# Altium project Smart_home_IOT - Copy.PrjPcb
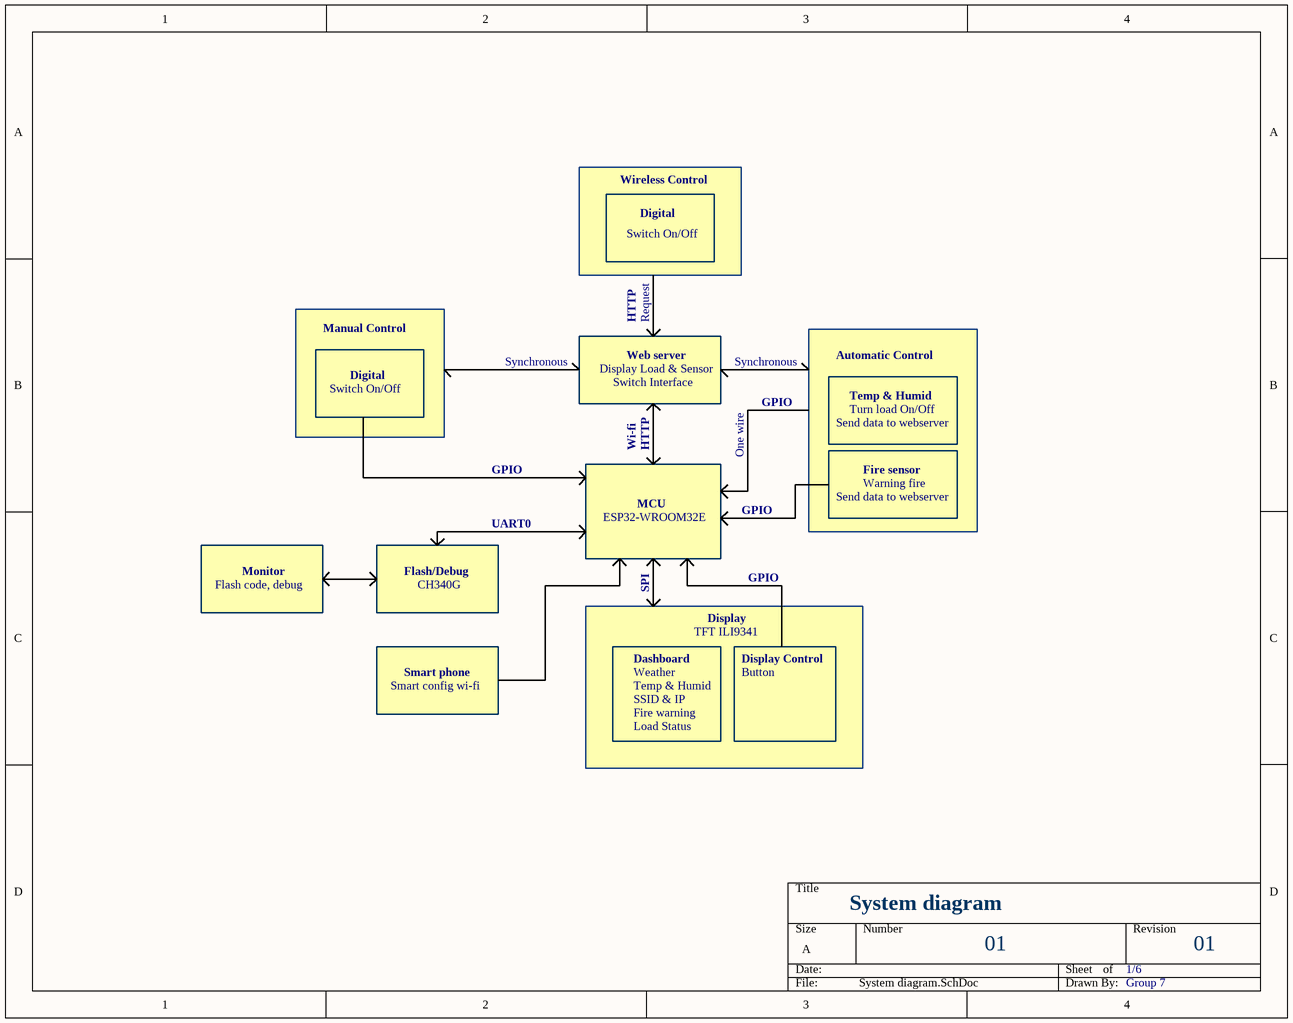
[diagram p0:  System diagram.SchDoc]
6 sheets, 122 parts. Net scope: flat (ports and power ports of the same name join across sheets).
Board files:  SMIOT_PCB_V2.PcbDoc,  SMIOT_PCB.PcbDoc,  SMIOT_Print.PcbDoc,  SMIOT_Single_Print.PcbDoc
Sheets:
   System diagram.SchDoc
   Power Diagram.SchDoc
   Power Circuit.SchDoc
   MCU.SchDoc
   Input.SchDoc
   Output.SchDoc

## Sheet  System diagram.SchDoc
size A; Author: Tinh Chau; DrawnBy: Group 7; SheetNumber: 1; SheetTotal: 6

### Notes on the sheet
- Wireless Control
- Switch On/Off
- Digital
- Manual Control
- Synchronous
- Display Load & Sensor
- Web server
- HTTP
- Request
- Automatic Control
- Switch Interface
- GPIO
- Send data to webserver
- Temp & Humid
- Turn load On/Off
- MCU
- Wi-fi
- One wire
- Fire sensor
- Warning fire
- UART0
- ESP32-WROOM32E
- Flash code, debug
- Monitor
- Flash/Debug
- CH340G
- SPI
- TFT ILI9341
- Display
- Smart config wi-fi
- Smart phone
- Dashboard
- Weather
- SSID & IP
- Display Control
- Button
- Fire warning
- Load Status
- System diagram
- 01
- 1/6
- Group 7

## Sheet  Power Diagram.SchDoc
size A; SheetNumber: 2; SheetTotal: 6
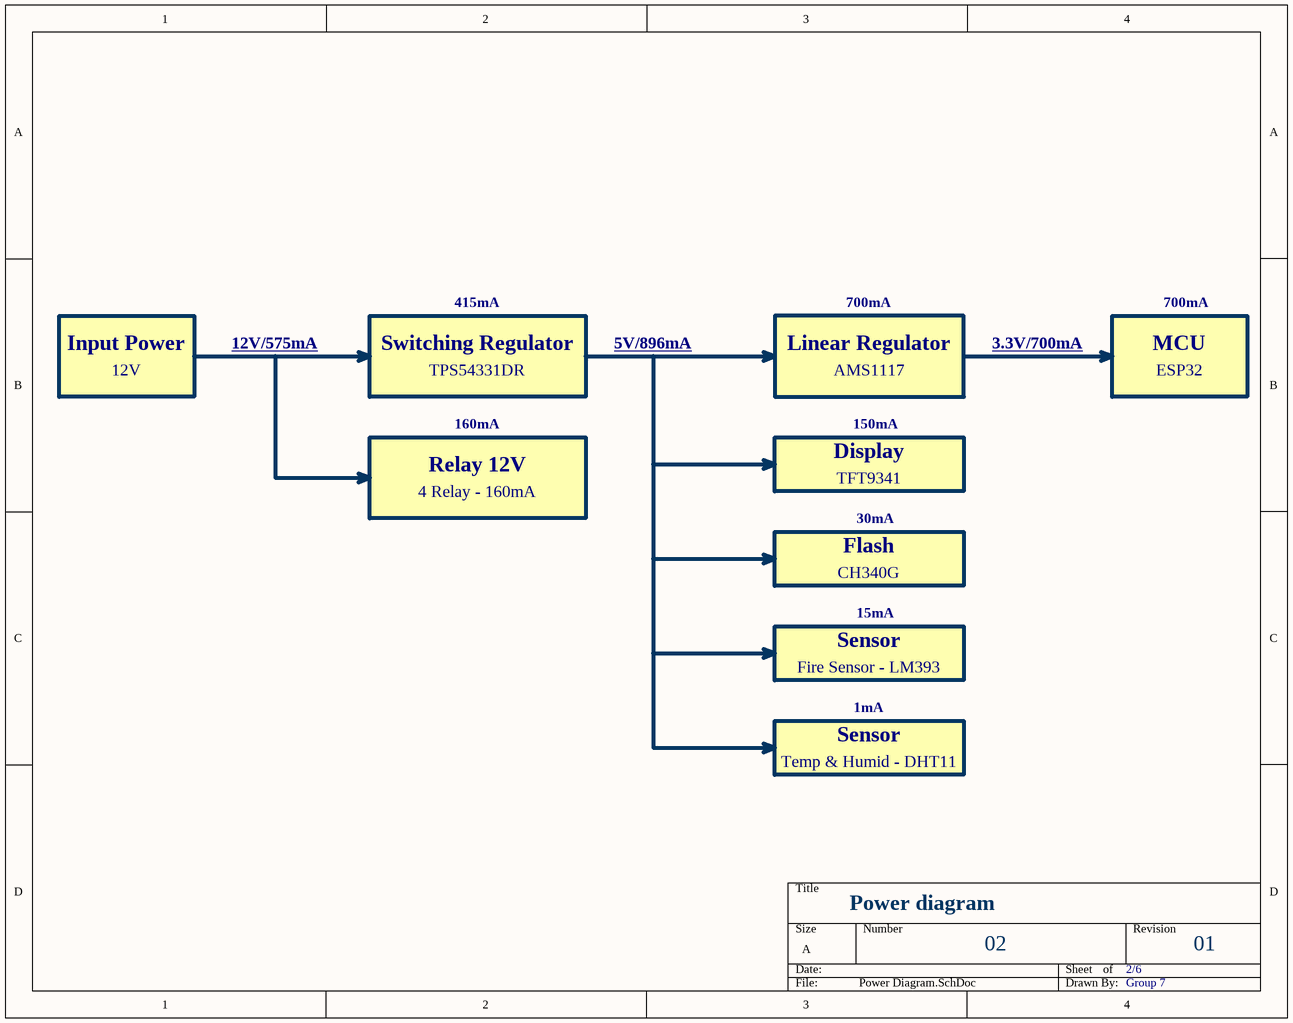
[diagram p1:  Power Diagram.SchDoc]

### Notes on the sheet
- 415mA
- 700mA
- Input Power
- 12V
- 12V/575mA
- TPS54331DR
- Switching Regulator
- 5V/896mA
- Linear Regulator
- AMS1117
- 3.3V/700mA
- MCU
- ESP32
- 160mA
- 150mA
- Relay 12V
- 4 Relay - 160mA
- Display
- TFT9341
- Flash
- CH340G
- 30mA
- Sensor
- 15mA
- Fire Sensor - LM393
- 1mA
- Temp & Humid - DHT11
- Power diagram
- 02
- 2/6
- 01
- Group 7

## Sheet  Power Circuit.SchDoc
size A; SheetNumber: 3; SheetTotal: 6
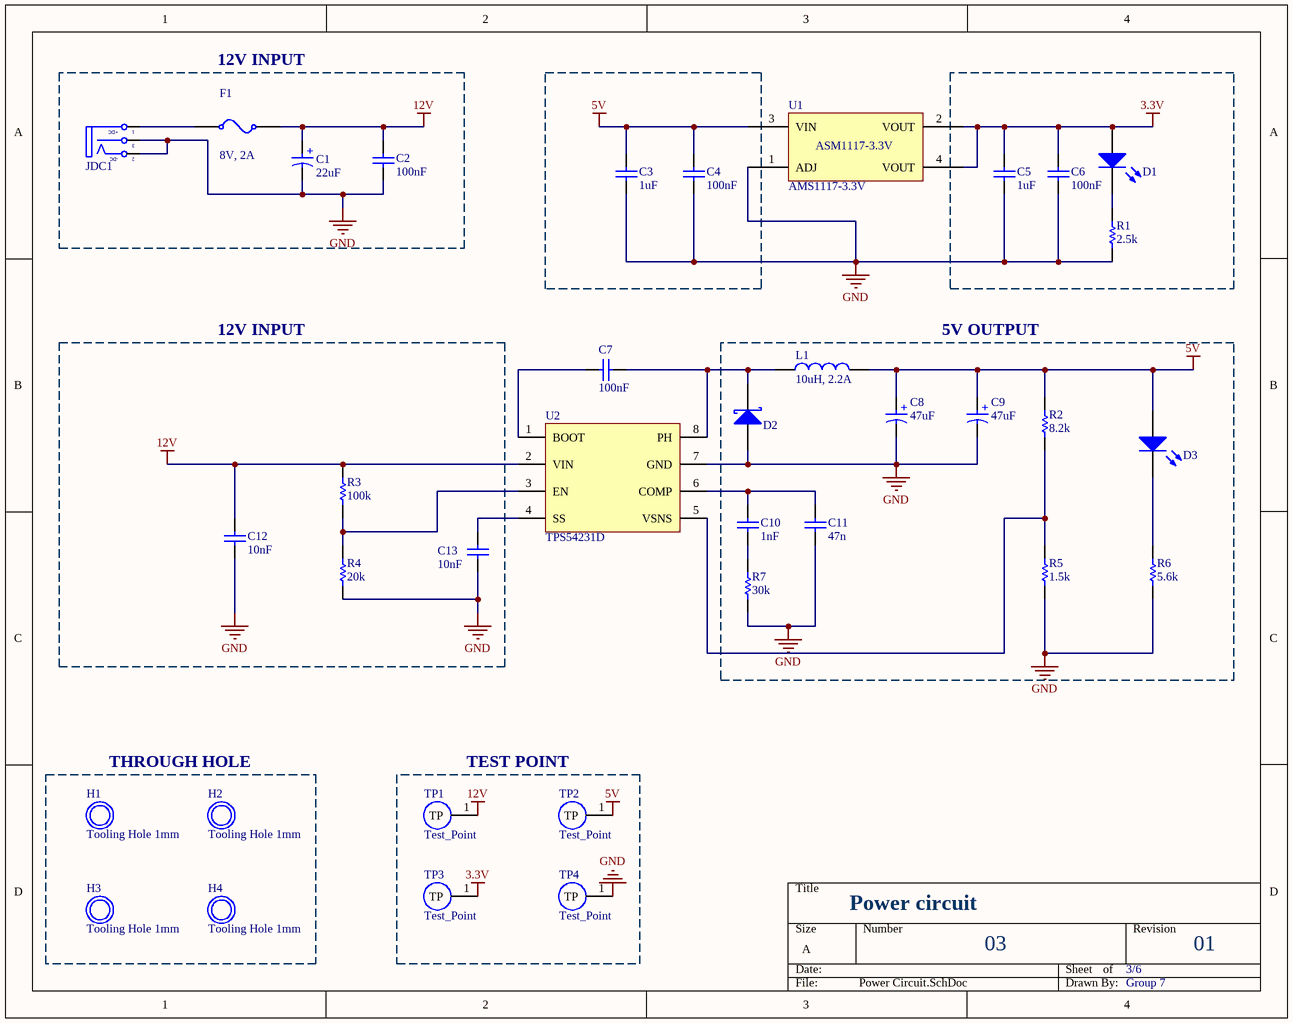
[diagram p2:  Power Circuit.SchDoc]

### Parts
C1  22uF  [WCAP-ASLI_D4H5.5]
C2  100nF  [CAP_0603]
C3  1uF  [CAP_0603]
C4  100nF  [CAP_0603]
C5  1uF  [CAP_0603]
C6  100nF  [CAP_0603]
C7  100nF  [CAP_0603]
C8  47uF  [WCAP-ASLI_D5H5.5]
C9  47uF  [WCAP-ASLI_D5H5.5]
C10  1nF  [CAP_0603]
C11  47n  [CAP_0603]
C12  10nF  [CAP_0603]
C13  10nF  [CAP_0603]
D1  LED SMD  [LED_0805_Blue]  (value not drawn)
D2  D Schottky  [SS34]  (value not drawn)
D3  LED SMD  [LED_0805_Blue]  (value not drawn)
F1  8V, 2A  [Fuse_SMD_1812]
H1  Tooling Hole 1mm  [2mm]
H2  Tooling Hole 1mm  [2mm]
H3  Tooling Hole 1mm  [2mm]
H4  Tooling Hole 1mm  [2mm]
JDC1  Jack DC  [DC-IN]  (value not drawn)
L1  10uH, 2.2A  [WE-PD2A_5848]
R1  2.5k  [resistor_0603]
R2  8.2k  [resistor_0603]
R3  100k  [resistor_0603]
R4  20k  [resistor_0603]
R5  1.5k  [resistor_0603]
R6  5.6k  [resistor_0603]
R7  30k  [resistor_0603]
TP1  Test_Point  [TP_2MM]
TP2  Test_Point  [TP_2MM]
TP3  Test_Point  [TP_2MM]
TP4  Test_Point  [TP_2MM]
U1  AMS1117-3.3V  [AMS1117-3.3V SOT223]
U2  TPS54231D  [SOIC8]

### Blocks framed on the sheet
12V INPUT: C1 C2 F1 JDC1
12V INPUT: C12 C13 R3 R4
5V OUTPUT: C8-C11 D2 D3 L1 R2 R5-R7
THROUGH HOLE: H1-H4
TEST POINT: TP1-TP4

### Nets
3.3V: C5.1 C6.1 D1.1(A) TP3.1(TP) U1.2(VOUT) U1.4(VOUT)
5V: C3.1 C4.1 C8.1(P) C9.1(P) D3.1(A) L1.2 R2.2 TP2.1(TP) U1.3(VIN)
12V: C1.1(P) C2.1 C12.1 F1.1 R3.1 TP1.1(TP) U2.2(VIN)
GND: C1.2(N) C2.2 C3.2 C4.2 C5.2 C6.2 C8.2(N) C9.2(N) C11.2 C12.2 C13.2 D2.1(A) JDC1.2(TN) JDC1.3(S) R1.2 R4.2 R5.2 R6.2 R7.2 TP4.1(TP) U1.1(ADJ) U2.7(GND)
NetC7_1: C7.1 U2.1(BOOT)
NetC7_2: C7.2 D2.2(K) L1.1 U2.8(PH)
NetC10_1: C10.1 C11.1 U2.6(COMP)
NetC10_2: C10.2 R7.1
NetC13_1: C13.1 U2.4(SS)
NetD1_2: D1.2(K) R1.1
NetD3_2: D3.2(K) R6.1
NetF1_0: F1.0 JDC1.1(T)
NetR2_1: R2.1 R5.1 U2.5(VSNS)
NetR3_2: R3.2 R4.1 U2.3(EN)

### Notes on the sheet
- Power circuit
- 03
- 3/6
- 01
- Group 7

### Library data of the parts
C1 = 865080340003: V-Chip, D4 x H5.5mm, 22uF, 16V; Capacitance Tolerance: +/-20%; Dissipation Factor: 16%; Endurance: 2000h; Leakage Current: 3.52uA; Ripple Current: 90mA; Supply 1 Name: Mouser; Supply 1 SN: 710-865080340003; Supply 2 Name: thegioiic; Category: Aluminum Electrolytic Capacitors; ComponentLink2Description: Datasheet Link; ComponentLink2URL: https://www.we-online.com/redexpert/spec/865080340003?ad; Mount: Surface Mount; Operating Temperature Max: 105°C; Operating Temperature Min: -55°C; Packaging: Tape and Reel; Height: 5.5mm; Diameter: 4mm; Capacitance: 22uF; Rated Voltage (DC): 16V; Supply 1 URL: https://www.mouser.com/ProductDetail/Wurth-Elektronik/865080340003?qs=0KOYDY2FL2%252BowmC4S50IuQ%3D%3D; Supply 2 URL: https://www.thegioiic.com/tu-nhom-smd-22uf-16v-4x5-4mm
C2 C4 C6 C7 = 01060310410: CAP, size 0603, 100nF; Supply 1 SN: 885012206095; Supply 1 name: Wurth Elektronik; Supply 2 name: Thegioiic; Capacitance Tolerance: +/-10%; ComponentLink1Description: Manufacturer; ComponentLink1URL: http://www.we-online.de; ComponentLink2Description: Datasheet; ComponentLink2URL: https://www.we-online.com/catalog/datasheet/885012206095.pdf; Operating Temperature: -55 to +125degC; Packaging: Tape and Reel; Supply 1 URL: https://www.we-online.com/en/components/products/WCAP-CSGP-50VDC?sq=885012206095R#885012206095R; Supply 2 SN: *; Supply 2 URL: https://www.thegioiic.com/tu-gom-0603-100nf-0-1uf-50v; Dissipation Factor: *; Height: *; Mounting Technology: SMT; Size: 0603; Capacitance: 100nF; Technical Reference: *
C3 C5 = 01060310510: CAP, size 0603, 1uF; Supply 1 SN: 885012206126; Supply 1 name: Wurth Elektronik; Supply 2 name: Thegioiic; Capacitance Tolerance: +/-10%; ComponentLink1Description: Manufacturer; ComponentLink1URL: http://www.we-online.de; ComponentLink2Description: Datasheet; ComponentLink2URL: https://www.we-online.com/components/products/datasheet/885012206126.pdf; Operating Temperature: -55 to +125degC; Packaging: Tape and Reel; Supply 1 URL: https://www.we-online.com/en/components/products/WCAP-CSGP-50VDC?sq=885012206126#885012206126; Supply 2 SN: *; Supply 2 URL: https://www.thegioiic.com/tu-gom-0603-1uf-50v; Dissipation Factor: *; Height: *; Mounting Technology: SMT; Size: 0603; Capacitance: 1uF; Technical Reference: *
C8 C9 = 865080342006: V-Chip, D5 x H5.5mm, 47uF, 16V; Capacitance Tolerance: +/-20%; Dissipation Factor: 16%; Endurance: 2000h; Leakage Current: 7.52uA; Ripple Current: 195mA; Supply 1 Name: Mouser; Supply 1 SN: 710-865080262015; Supply 2 Name: thegioiic; Category: Aluminum Electrolytic Capacitors; ComponentLink2Description: Datasheet Link; ComponentLink2URL: https://www.we-online.com/redexpert/spec/865080342006?ad; Mount: Surface Mount; Operating Temperature Max: 105°C; Operating Temperature Min: -55°C; Packaging: Tape and Reel; Height: 5.5mm; Diameter: 5mm; Capacitance: 47uF; Rated Voltage (DC): 16V; Supply 1 URL: https://www.mouser.com/ProductDetail/Wurth-Elektronik/865080262015?qs=0KOYDY2FL2%2Ffe5w2MssUoQ%3D%3D; Supply 2 URL: https://www.thegioiic.com/tu-nhom-smd-47uf-16v-5x5-4mm
C10 = 0106031025: CAP, size 0603, 1nF; Supply 1 SN: 885012006063; Supply 1 name: Wurth Elektronik; Capacitance Tolerance: +/-5%; ComponentLink1Description: Manufacturer; ComponentLink1URL: http://www.we-online.de; ComponentLink2Description: Datasheet; ComponentLink2URL: https://www.we-online.com/components/products/datasheet/885012006063.pdf; Operating Temperature: -55 to +125degC; Packaging: Tape and Reel; Supply 1 URL: https://www.we-online.com/en/components/products/WCAP-CSGP-50VDC?sq=885012007063#885012007063; Supply 2 SN: *; Supply 2 name: *; Supply 2 URL: *; Dissipation Factor: *; Height: *; Mounting Technology: SMT; Size: 0603; Capacitance: 1nF; Technical Reference: *
C11 = 01060347310: CAP, size 0603, 47nF; Supply 1 SN: 885012206093; Supply 1 name: Wurth Elektronik; Supply 2 name: Thegioiic; Capacitance Tolerance: +/-10%; ComponentLink1Description: Manufacturer; ComponentLink1URL: http://www.we-online.de; ComponentLink2Description: Datasheet; ComponentLink2URL: https://www.we-online.com/catalog/datasheet/885012206093.pdf; Operating Temperature: -55 to +125degC; Packaging: Tape and Reel; Supply 1 URL: https://www.we-online.com/en/components/products/WCAP-CSGP-50VDC?sq=885012206093#885012206093; Supply 2 SN: *; Supply 2 URL: https://www.thegioiic.com/tu-gom-0603-47nf-50v; Dissipation Factor: *; Height: *; Mounting Technology: SMT; Size: 0603; Capacitance: 47nF; Technical Reference: *
C12 C13 = 01060310310: CAP, size 0603, 10nF; Supply 1 SN: 885012206089; Supply 1 name: Wurth Elektronik; Supply 2 name: Thegioiic; Capacitance Tolerance: +/-10%; ComponentLink1Description: Manufacturer; ComponentLink1URL: http://www.we-online.de; ComponentLink2Description: Datasheet; ComponentLink2URL: https://www.we-online.com/catalog/datasheet/885012206089.pdf; Operating Temperature: -55 to +125degC; Packaging: Tape and Reel; Supply 1 URL: https://www.we-online.com/en/components/products/WCAP-CSGP-50VDC?sq=885012206089#885012206089; Supply 2 SN: *; Supply 2 URL: https://www.thegioiic.com/tu-gom-0603-10nf-50v; Dissipation Factor: *; Height: *; Mounting Technology: SMT; Size: 0603; Capacitance: 10nF; Technical Reference: *
D1 D3 = LED SMD: LED
D2 = D Schottky: Schottky Diode; Published: 8-Jun-2000; LatestRevisionDate: 17-Jul-2002; LatestRevisionNote: Re-released for DXP Platform.; PackageReference: SMB; Publisher: Altium Limited; PackageDescription: DO-214-AA/SMB; 2 C-Bend Leads; Body 5.3 x 3.6 mm, inc. leads (LxW); Code_JEDEC: DO-214-AA
F1 = 061812200008: Resettable Fuse, Size 1812, 8V, 2A; Manufacturer: Littelfuse; Threshold Current: 100A; Trip Current: 4A; Supply 1 Name: Mouser; Supply 1 SN: 650-MINISMDC200F-2; Supply 2 Name: Digikey; Supply 2 SN: MINISMDC200F-2TR-ND; Supply 3 Name: Thegioiic; Threshold Voltage: 8V; Hold Current: 2A; Size: 1812; Mounting Technology: SMT/SMD; ComponentLink1Description: Datasheet link; ComponentLink1URL: https://www.littelfuse.com/~/media/electronics/product_specifications/resettable_ptcs/littelfuse_ptc_minismdc300f_2_product_specification.pdf.pdf; ComponentLink2Description: Supply 1 URL; ComponentLink2URL: https://www.mouser.vn/ProductDetail/Littelfuse/MINISMDC200F-2?qs=F6FIpiMdEVbPu4q%2F42CC1w%3D%3D; ComponentLink3Description: Supply 2 URL; ComponentLink3URL: https://www.digikey.com/en/products/detail/littelfuse-inc/MINISMDC200F-2/1045898?s=N4IgTCBcDaIAQFkCSA5JBlBARAwmADPgGIC0EAugL5A; ComponentLink4Description: Supply 3 URL; ComponentLink4URL: https://www.thegioiic.com/cau-chi-tu-phuc-hoi-1812-8v-2a; Supply 3 SN: N/A
H1-H4 = Tooling Hole 2mm
JDC1 = Jack DC: Jack DC input; Value: Jac DC
L1 = 78477410: WE-PD2A SMT Power Inductor, size 5848, 10uH, 2.2A; Manufacturer: Wurth Elektronik; DC Resistance max.: 0.1Ohm; Saturation Current: 2.5A; Self Resonant Frequency: 26MHz; DC Resistance typ.: 0.078Ohm; Rated Voltage: 80VDC; Supply 1 Name: Digi-Key; Supply 1 SN: 732-6830-2-ND; Supply 2 Name: Mouser; Supply 2 SN: 710-78477410; Supply 3 Name: thegioiic; ComponentLink1Description: Manufacturer; ComponentLink1URL: http://www.we-online.de; ComponentLink2Description: Datasheet; ComponentLink2URL: https://www.we-online.com/catalog/datasheet/78477410.pdf; Manufacturer Part Number: 78477410; Published Date: May 2020; Rated Current: 2.2A; Inductance: 10uH; Operating Temperature: -40 to +125degC; Mounting Technology: SMT; Packaging: Tape and Reel; Size: 5848; Supply 1 URL: https://www.digikey.com/en/products/detail/w%C3%BCrth-elektronik/78477410/5168779?s=N4IgTCBcDaIOwA4Asc5IIwAYQF0C%2BQA; Supply 2 URL: https://www.mouser.vn/ProductDetail/Wurth-Elektronik/78477410?qs=sBf%2Fb4nBSldlX6CYaJExDg%3D%3D; Supply 3 URL: https://www.thegioiic.com/cuon-cam-dan-smd-cd53-5852-100-10uh-1-8a
R1 = 0006032525: RES, 2.5K Ohm, size 0603, 5%; Resistance tolerance: +/-5%; Rated Power: 1/4 W; Size: 0603; Mounting Technology: SMT; Datasheet: *; Resistance: 2.5K; ComponentLink1Description: Datasheet link; ComponentLink1URL: *; Supply 1 Name: *; Supply 1 SN: *; Supply 1 URL: *; Supply 2 Name: *; Supply 2 SN: *; Supply 2 URL: *; Supply 3 Name: *; Supply 3 SN: *; Supply 3 URL: *; Manufacture  Name: *; Manufacture  SN: *
R2 = 0006038251: RES, 8.2 kOhms, size 0603, 1%; Resistance tolerance: +/-1%; Rated Power: 1/4 W; Supply 1 Name: Mouser; Supply 1 SN: 660-HV731JTTD8204F; Supply 2 Name: Digi-Key; Supply 2 SN: 13-RC0603FR-078M2LTR-ND; Size: 0603; Mounting Technology: SMT; Resistance: 8.2K; ComponentLink1Description: Datasheet link; ComponentLink1URL: *; Supply 1 URL: https://www.mouser.vn/ProductDetail/KOA-Speer/HV731JTTD8204F?qs=ZqVPfSd1khqN0teaqWW7DA%3D%3D; Supply 2 URL: https://www.digikey.com/en/products/detail/yageo/RC0603FR-078M2L/5918418; Supply 3 Name: *; Supply 3 SN: *
R3 = 0006031041: RES, 100k Ohm, size 0603, 1%; Resistance Tolerant: +/-1%; Rated Power: 1/4W; Supply 1 Name: Mouser; Supply 1 SN: 603-SR0603FR-7T100KL; Supply 2 Name: Digikey; Supply 2 SN: YAG5821TR-ND YAG5821CT-ND YAG5821DKR-ND; Resistance: 100k; Size: 0603; Mounting Technology: SMT; ComponentLink1Description: Datasheet link; ComponentLink1URL: https://www.yageo.com/upload/media/product/productsearch/datasheet/rchip/PYu-SR_20105_RoHS_L_10.pdf; ComponentLink2Description: Supply 1 URL; ComponentLink2URL: https://www.mouser.vn/ProductDetail/YAGEO/SR0603FR-7T100KL?qs=sGAEpiMZZMvdGkrng054tz1y1XEHv7sNa%252BA%2F4WiDMf7aGw4zRBb%2FFQ%3D%3D; ComponentLink3Description: Supply 2 URL; ComponentLink3URL: https://www.digikey.com/en/products/detail/yageo/SR0603FR-7T100KL/9373095
R4 = 0006032031: RES, 20 kOhms, size 0603, 1%; Resistance tolerance: +/-1%; Rated Power: 1/4 W; Supply 1 Name: Mouser; Supply 1 SN: 667-ERJ-S03F2002V; Supply 2 Name: Digi-Key; Supply 2 SN: 13-RC0603FR-1320KLTR-ND; Size: 0603; Mounting Technology: SMT; Resistance: 20 k; ComponentLink1Description: Datasheet link; ComponentLink1URL: *; Supply 1 URL: https://www.mouser.vn/ProductDetail/Panasonic/ERJ-S03F2002V?qs=Zyl8A9hlmJopfTdqNIDujw%3D%3D; Supply 2 URL: https://www.digikey.com/en/products/detail/yageo/RC0603FR-1320KL/13694225; Supply 3 Name: *; Supply 3 SN: *
R5 = 0006031521: RES, 1.5 kOhms, size 0603, 1%; Resistance tolerance: +/-1%; Rated Power: 1/4 W; Supply 1 Name: Mouser; Supply 1 SN: 755-SFR03EZPF1501; Supply 2 Name: Digi-Key; Supply 2 SN: 13-RC0603FR-071R5LTR-ND; Size: 0603; Mounting Technology: SMT; Resistance: 1.5 k; ComponentLink1Description: Datasheet link; ComponentLink1URL: *; Supply 1 URL: https://www.mouser.vn/ProductDetail/ROHM-Semiconductor/SFR03EZPF1501?qs=byeeYqUIh0NryWvnzlukLQ%3D%3D; Supply 2 URL: https://www.digikey.com/en/products/detail/yageo/RC0603FR-071R5L/5918292; Supply 3 Name: *; Supply 3 SN: *
R6 = 0006035621: RES, 5.6k Ohm, size 0603, 1%; Resistance Tolerant: +/-1%; Rated Power: 1/4W; Supply 1 Name: Mouser; Supply 1 SN: 667-ERJ-UP3F5601V; Supply 2 Name: Digikey; Supply 2 SN: 10-ERJ-UP3F5601VTR-ND 10-ERJ-UP3F5601VCT-ND 10-ERJ-UP3F5601VDKR-ND; Resistance: 5.6k; Size: 0603; Mounting Technology: SMT; ComponentLink1Description: Datasheet link; ComponentLink1URL: https://api.pim.na.industrial.panasonic.com/file_stream/main/fileversion/4484; ComponentLink2Description: Supply 1 URL; ComponentLink2URL: https://www.mouser.vn/ProductDetail/Panasonic/ERJ-UP3F5601V?qs=sGAEpiMZZMvdGkrng054twq3eZrCFN89ezYxgAsnxBTZYD17cS%252B65A%3D%3D; ComponentLink3Description: Supply 2 URL; ComponentLink3URL: https://www.digikey.com/en/products/detail/panasonic-electronic-components/ERJ-UP3F5601V/12092890
R7 = 0006033205: RES, 30k Ohm, size 0603, 1%; Resistance tolerance: +/-1%; Rated Power: 1/4 W; Size: 0603; Mounting Technology: SMT; Datasheet: *; Resistance: 30k; ComponentLink1Description: Datasheet link; ComponentLink1URL: *; Supply 1 Name: *; Supply 1 SN: *; Supply 1 URL: *; Supply 2 Name: *; Supply 2 SN: *; Supply 2 URL: *; Supply 3 Name: *; Supply 3 SN: *; Supply 3 URL: *; Manufacture  Name: *; Manufacture  SN: *
TP1-TP4 = Test_Point: Test point, 2mm radius
U1 = AMS1117-3.3V: AMS1117-3.3V, OUT 3.3V 1A.; Manufacturer: AMS; Pad Count: 4; Current Output Maximum: 1A; Voltage Input Maximum: 15V; Manufacturer Part Number: *; Part Number: *; Current Input Maximum: *; Supplier 1 Link: *; Supplier 1 Name: *; Supplier 2 Link: *; Supplier 2 Name: *; Supplier 2 Part Number: *; Supplier 3 Link: https://www.thegioiic.com/ams1117-3-3v-ic-on-ap-3-3v-1a-sot-223; Supplier 3 Name: ThegioiIC; Supplier 3 Part Number: *; Voltage Output: 3.3V; Mounting Technology: SMD; Supplier 1 Part Number: *; Datasheet: http://www.advanced-monolithic.com/pdf/ds1117.pdf
U2 = TPS54231: Buck Switching Regulator IC Positive Adjustable 0.8V 1 Output 2A 8-SOIC (0.154", 3.90mm Width); Mfr: Texas Instruments; Function: Step-Down; Number of Outputs: 1; Voltage - Input (Min): 3.5V; Voltage - Input (Max): 28V; Voltage - Output (Max): 25V; Frequency - Switching: 570kHz; Category: Integrated Circuits (ICs); Output Configuration: Positive; Topology: Buck; Output Type: Adjustable; Voltage - Output (Min/Fixed): 0.8V; Current - Output: 2A; Operating Temperature: -40°C ~ 150°C (TJ); Mounting Type: Surface Mount; ComponentLink1Description: Thegioiic; ComponentLink1URL: https://www.thegioiic.com/tps54231dr-ic-dieu-chinh-giam-ap-2a-8-soic; ComponentLink2Description: Datasheet; ComponentLink2URL: https://www.ti.com/lit/ds/symlink/tps54231.pdf

## Sheet  MCU.SchDoc
size A; SheetNumber: 4; SheetTotal: 6
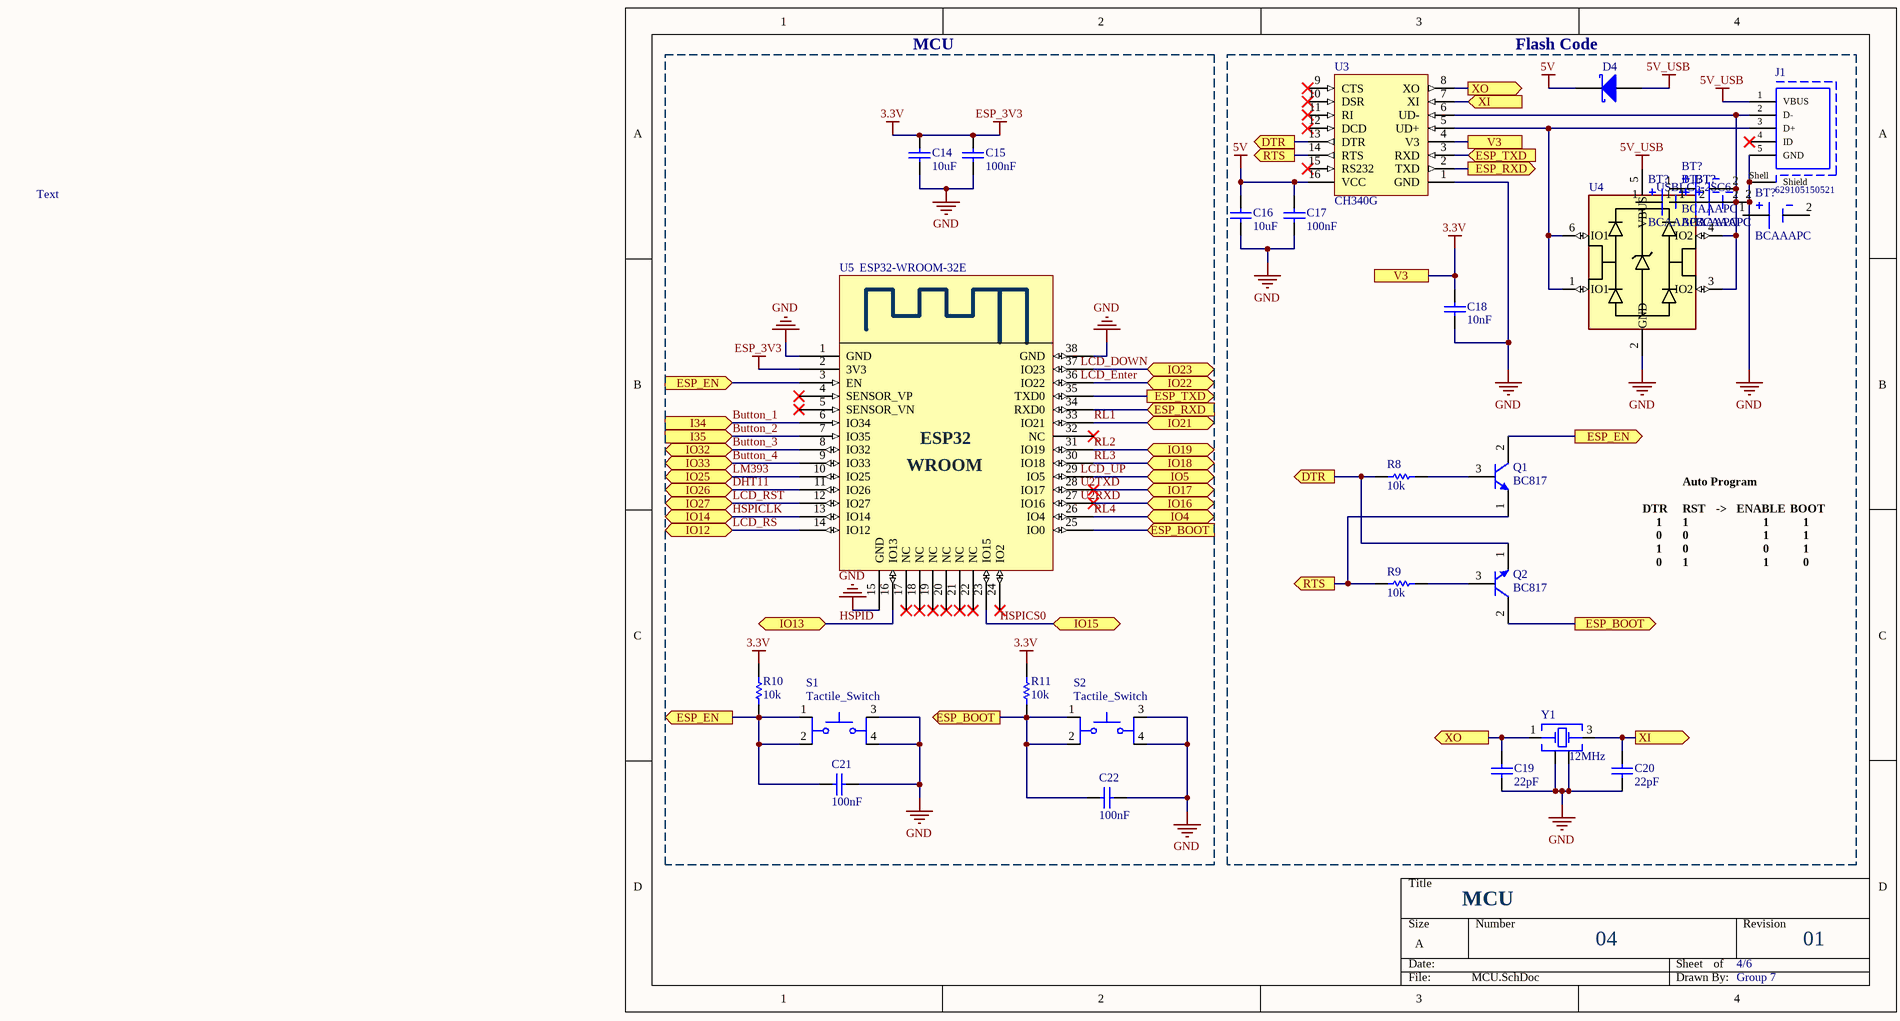
[diagram p3:  MCU.SchDoc, left]
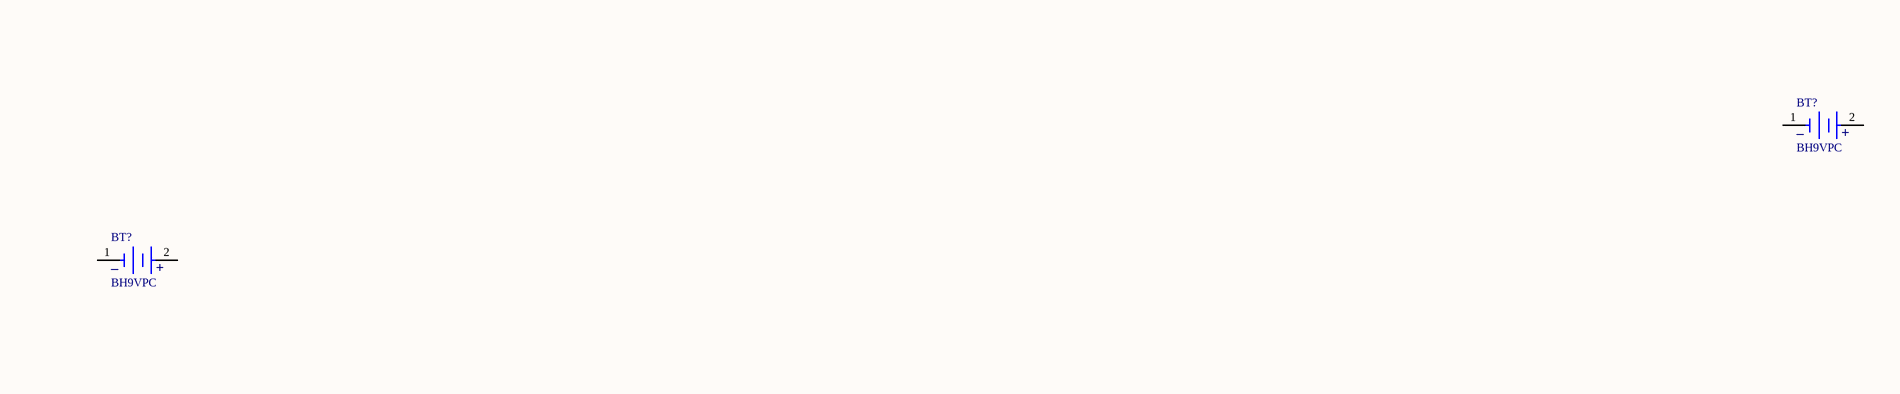
[diagram p4:  MCU.SchDoc, right]

### Parts
(Parts that share a designator on the sheet are numbered #1, #2 ... from top to bottom, then left to right.)
BT?#1  BCAAAPC  [BCAAAPC]
BT?#2  BCAAAPC  [BCAAAPC]
BT?#3  BCAAAPC  [BCAAAPC]
BT?#4  BCAAAPC  [BCAAAPC]
BT?#5  BCAAAPC  [BCAAAPC]
BT?#6  BCAAAPC  [BCAAAPC]
BT?#7  BH9VPC  [FP-BH9VPC-MFG]
BT?#8  BH9VPC  [FP-BH9VPC-MFG]
C14  10uF  [CAP_0603]
C15  100nF  [CAP_0603]
C16  10uF  [CAP_0603]
C17  100nF  [CAP_0603]
C18  10nF  [CAP_0603]
C19  22pF  [CAP_0603]
C20  22pF  [CAP_0603]
C21  100nF  [CAP_0603]
C22  100nF  [CAP_0603]
D4  D Schottky  [SS34]  (value not drawn)
J1  629105150521  [629105150521]
Q1  BC817  [SOT23B]
Q2  BC817  [SOT23B]
R8  10k  [resistor_0603]
R9  10k  [resistor_0603]
R10  10k  [resistor_0603]
R11  10k  [resistor_0603]
S1  Tactile_Switch  [Tactile_Button_3x4x2.5]
S2  Tactile_Switch  [Tactile_Button_3x4x2.5]
U3  CH340G  [DSIP-16]
U4  USBLC6-2SC6  [SOT95P280X145-6N]
U5  ESP32-WROOM-32E  [ESP32-WROOM]
Y1  12MHz  [WE-XTAL_CFPX-104]

### Blocks framed on the sheet
MCU: C14 C15 C21 C22 R10 R11 S1 S2 U5
Flash Code: BT?#1-BT?#6 C16-C20 D4 J1 Q1 Q2 R8 R9 U3 U4 Y1

### Ports
DTR (out), ESP_BOOT (in), ESP_BOOT (out), ESP_EN (in), ESP_EN (out), ESP_RXD (in), ESP_RXD (out), ESP_TXD (in), ESP_TXD (out), I34 (in), I35 (in), IO4 (bidir), IO5 (bidir), IO12 (bidir), IO13 (bidir), IO14 (bidir), IO15 (bidir), IO16 (bidir), IO17 (bidir), IO18 (bidir), IO19 (bidir), IO21 (bidir), IO22 (bidir), IO23 (bidir), IO25 (bidir), IO26 (bidir), IO27 (bidir), IO32 (bidir), IO33 (bidir), RTS (out), V3, XI (in), XI (out), XO (out)

### Nets
3.3V: C14.1 C15.1 C18.1 R10.1 R11.1 U3.4(V3) U5.2(3V3) ; port V3  [also labelled ESP_3V3]
5V: C16.2 C17.1 D4.2(K) U3.16(VCC)
5V_USB: D4.1(A) J1.1(VBUS) U4.5(VBUS)
GND: BT?#4.2(NEG) BT?#5.2(NEG) C14.2 C15.2 C16.1 C17.2 C18.2 C19.1 C20.1 C21.2 C22.2 J1.5(GND) J1.Shell(Shield) S1.3 S1.4 S2.3 S2.4 U3.1(GND) U4.2(GND) U5.1(GND) U5.15(GND) U5.38(GND) Y1.2(GND_&_Lid) Y1.4(GND_&_Lid)
Button_1: U5.6(IO34) ; port I34
Button_2: U5.7(IO35) ; port I35
Button_3: U5.8(IO32) ; port IO32
Button_4: U5.9(IO33) ; port IO33
DHT11: U5.11(IO26) ; port IO26
HSPICLK: U5.13(IO14) ; port IO14
HSPICS0: U5.23(IO15) ; port IO15
HSPID: U5.16(IO13) ; port IO13
LCD_Enter: U5.36(IO22) ; port IO22
LCD_RS: U5.14(IO12) ; port IO12
LCD_RST: U5.12(IO27) ; port IO27
LCD_UP: U5.29(IO5) ; port IO5
LDC_DOWN: U5.37(IO23) ; port IO23
LM393: U5.10(IO25) ; port IO25
RL1: U5.33(IO21) ; port IO21
RL2: U5.31(IO19) ; port IO19
RL3: U5.30(IO18) ; port IO18
RL4: U5.26(IO4) ; port IO4
NetBT?#1_2: BT?#1.2(NEG) BT?#3.2(NEG) J1.2(D-) U3.6(UD-) U4.3(IO2) U4.4(IO2)
NetBT?#4_1: BT?#4.1(POS) BT?#5.1(POS)
NetC19_2: C19.2 U3.8(XO) Y1.1(Crystal) ; port XO
NetC20_2: C20.2 U3.7(XI) Y1.3(Crystal) ; port XI
NetC21_1: C21.1 Q1.2(C) R10.2 S1.1 S1.2 U5.3(EN) ; port ESP_EN
NetC22_1: C22.1 Q2.2(C) R11.2 S2.1 S2.2 U5.25(IO0) ; port ESP_BOOT
NetJ1_3: J1.3(D+) U3.5(UD+) U4.1(IO1) U4.6(IO1)
NetQ1_1: Q1.1(E) R9.1 U3.14(RTS) ; port RTS
NetQ1_3: Q1.3(B) R8.2
NetQ2_1: Q2.1(E) R8.1 U3.13(DTR) ; port DTR
NetQ2_3: Q2.3(B) R9.2
NetU3_2: U3.2(TXD) U5.34(RXD0) ; port ESP_RXD
NetU3_3: U3.3(RXD) U5.35(TXD0) ; port ESP_TXD
NetU5_27: U5.27(IO16) ; port IO16
NetU5_28: U5.28(IO17) ; port IO17

Not connected (* = marked no-connect by the designer): BT?#1 1(POS); BT?#2 1(POS) 2(NEG); BT?#3 1(POS); BT?#6 1(POS) 2(NEG); BT?#7 1(NEG) 2(POS); BT?#8 1(NEG) 2(POS); J1 4(ID)*; U3 9(CTS)* 10(DSR)* 11(RI)* 12(DCD)* 15(RS232)*; U5 4(SENSOR_VP)* 5(SENSOR_VN)* 17(NC)* 18(NC)* 19(NC)* 20(NC)* 21(NC)* 22(NC)* 24(IO2)* 32(NC)*

### Notes on the sheet
- Text
- Auto Program
- DTR
- 1
- 0
- RST
- ->
- ENABLE
- BOOT
- MCU
- 04
- 4/6
- 01
- Group 7
- Labels drawn without touching a wire or pin: LCD_DOWN, LCD_Enter, LCD_UP, U2RXD, U2TXD

### Library data of the parts
BT?#1-BT?#6 = CMP-00029-00004-2: BATTERY HOLDER AAA PC PIN; ComponentLink1Description: Local Supply (Thegioiic); ComponentLink1URL: https://www.thegioiic.com/hop-pin-1xaaa-xuyen-lo-han-pcb
BT?#7 BT?#8 = CMP-00029-00001-2: Battery Holder (Open) 9V 1 Cell PC Pin.; RoHS Compliant: Yes; Mounting Technology: THT; Pins: 2; ComponentLink1URL: https://www.thegioiic.com/de-pin-9v-han-pcb; ComponentLink1Description: Local Supply 1 (Thegioiic
C14 C16 = 01060310010: CAP, size 0603,10uF; Supply 2 name: Thegioiic; Capacitance Tolerance: +/-10%; ComponentLink1Description: Manufacturer; ComponentLink1URL: *; ComponentLink2Description: Datasheet; ComponentLink2URL: *; Operating Temperature: -55 to +125degC; Packaging: Tape and Reel; Supply 1 SN: *; Supply 1 name: *; Supply 1 URL: *; Supply 2 SN: *; Supply 2 URL: https://www.thegioiic.com/tu-gom-0603-10uf-16v; Dissipation Factor: *; Height: *; Mounting Technology: SMT; Size: 0603; Capacitance: 10uF; Technical Reference: *
C15 C17 C21 C22 = 01060310410: as C2 on sheet  Power Circuit; ComponentLink1Description: Manufacturer; ComponentLink1URL: http://www.we-online.de; ComponentLink2Description: Datasheet; ComponentLink2URL: https://www.we-online.com/catalog/datasheet/885012206095.pdf; Operating Temperature: -55 to +125degC; Packaging: Tape and Reel; Supply 1 URL: https://www.we-online.com/en/components/products/WCAP-CSGP-50VDC?sq=885012206095R#885012206095R; Supply 2 SN: *; Supply 2 URL: https://www.thegioiic.com/tu-gom-0603-100nf-0-1uf-50v; Dissipation Factor: *; Height: *; Mounting Technology: SMT; Size: 0603; Capacitance: 100nF; Technical Reference: *
C18 = 01060310310: as C12 on sheet  Power Circuit; ComponentLink1Description: Manufacturer; ComponentLink1URL: http://www.we-online.de; ComponentLink2Description: Datasheet; ComponentLink2URL: https://www.we-online.com/catalog/datasheet/885012206089.pdf; Operating Temperature: -55 to +125degC; Packaging: Tape and Reel; Supply 1 URL: https://www.we-online.com/en/components/products/WCAP-CSGP-50VDC?sq=885012206089#885012206089; Supply 2 SN: *; Supply 2 URL: https://www.thegioiic.com/tu-gom-0603-10nf-50v; Dissipation Factor: *; Height: *; Mounting Technology: SMT; Size: 0603; Capacitance: 10nF; Technical Reference: *
C19 C20 = 01060322010: CAP, size 0603, 22pF; Supply 2 name: Thegioiic; Capacitance Tolerance: +/-10%; ComponentLink1Description: Manufacturer; ComponentLink1URL: Thegioiic; ComponentLink2Description: Datasheet; ComponentLink2URL: *; Operating Temperature: -55 to +125degC; Packaging: Tape and Reel; Supply 1 SN: *; Supply 1 name: *; Supply 1 URL: *; Supply 2 SN: *; Supply 2 URL: https://www.thegioiic.com/tu-gom-0603-22pf-50v; *: *; Height: *; Mounting Technology: SMT; Size: 0603; Capacitance: 22pF; Technical Reference: *
D4 = D Schottky: Schottky Diode; Published: 8-Jun-2000; LatestRevisionDate: 17-Jul-2002; LatestRevisionNote: Re-released for DXP Platform.; PackageReference: SMB; Publisher: Altium Limited; PackageDescription: DO-214-AA/SMB; 2 C-Bend Leads; Body 5.3 x 3.6 mm, inc. leads (LxW); Code_JEDEC: DO-214-AA
J1 = 629105150521: Micro USB 2.0 Type B Receptacle WR-COM, Horizontal, SMT, with Pegs, High Current at Pin 1 & Pin 5; Rated Current: 3 A; Contact Resistance: 30 mOhm; Working Voltage: 30 VAC; ComponentLink1Description: Manufacturer; ComponentLink1URL: http://www.we-online.de; ComponentLink2Description: Datasheet; ComponentLink2URL: https://katalog.we-online.de/em/datasheet/629105150521.pdf; Part Number: 629105150521; Published Date: September 2018; Publisher: Wurth Elektronik; Orientation: Horizontal; Connector Type: Micro USB 2.0 Type B; Operating Temperature: -40 to 85 degC; Mounting Technology: SMT; Gender: Receptacle; Packaging: Tape and Reel
Q1 Q2 = BC817: NPN Bipolar Transistor
R8-R11 = 0006031031: RES, 10k Ohm, size 0603, 1%; Resistance Tolerant: +/-1%; Rated Power: 1/4W; Supply 1 Name: Mouser; Supply 1 SN: 755-ESR03EZPF1002; Supply 2 Name: Digikey; Supply 2 SN: RHM10KADTR-ND RHM10KADCT-ND RHM10KADDKR-ND; Resistance: 10k; Size: 0603; Mounting Technology: SMT; ComponentLink1Description: Datasheet link; ComponentLink1URL: https://fscdn.rohm.com/en/products/databook/datasheet/passive/resistor/chip_resistor/esr-e.pdf; ComponentLink2Description: Supply 1 URL; ComponentLink2URL: https://www.mouser.vn/ProductDetail/ROHM-Semiconductor/ESR03EZPF1002?qs=sGAEpiMZZMvdGkrng054t67Efho1F8r6CDeAsqwFse8%3D; ComponentLink3Description: Supply 2 URL; ComponentLink3URL: https://www.digikey.com/en/products/detail/rohm-semiconductor/ESR03EZPF1002/1983429
S1 S2 = Tactile_Switch: Tactile Switch, 3x4x2.5mm; MP: TL6700AF160QG; Supplier 1 URL: https://www.thegioiic.com/nut-nhan-3x4mm-cao-2-5mm-4-chan-smd; Package: None; Price: None; Availability: Unavailable; ComponentLink1Description: New link; ComponentLink1URL: *; Supplier 1 Name: Thegioiic
U3 = CH340: USB Bridge, USB to UART USB 2.0 UART Interface; Mfr: SparkFun Electronics; Standards: USB 2.0; Voltage - Supply: 3V ~ 3.6V; Current - Supply: 20mA; Protocol: USB; Function: Bridge, USB to UART; Interface: UART; Operating Temperature: -20°C ~ 70°C (TA); ComponentLink1Description: Thegioiic; ComponentLink1URL: https://www.thegioiic.com/ch340g; ComponentLink2Description: Datasheet; ComponentLink2URL: https://www.thegioiic.com/upload/documents/5d39d5f0043101a4c964078db79fe1bd.PDF
U4 = USBLC6-2SC6: 17V Clamp 5A (8/20Âµs) Ipp Tvs Diode Surface Mount SOT-23-6
U5 = ESP32-WROOM: Bluetooth, WiFi 802.11b/g/n, Bluetooth v4.2 +EDR, Class 1, 2 and 3 Transceiver Module 2.4GHz ~ 2.5GHz Integrated, Trace Surface Mount; Mfr: Espressif Systems; Utilized IC / Part: ESP32-D0WD-V3; Modulation: CCK, DSSS, OFDM; Data Rate: 150Mbps; Power - Output: 20dBm; Sensitivity: -98dBm; Serial Interfaces: ADC, GPIO, I²C, I²S, PWM, SDIO, SPI, UART; Memory Size: 4MB Flash, 448kB ROM, 536kB SRAM; Voltage - Supply: 3V ~ 3.6V; Category: RF and Wireless; Series: ESP32; RF Family/Standard: Bluetooth, WiFi; Protocol: 802.11b/g/n, Bluetooth v4.2 +EDR, Class 1, 2 and 3; Frequency: 2.4GHz ~ 2.5GHz; Antenna Type: Integrated, Trace; Mounting Type: Surface Mount; ComponentLink1Description: Hshop; ComponentLink1URL: https://hshop.vn/products/mach-thu-phat-wifi-ble-soc-esp32-v1; Operating Temperature: -40°C ~ 85°C; ComponentLink2Description: Datasheet; ComponentLink2URL: https://www.espressif.com/sites/default/files/russianDocumentation/esp32-wroom-32e_esp32-wroom-32ue_datasheet_en.pdf
Y1 = 830055999: WE-XTAL Quartz Crystal, SMT, CFPX-104, 12MHz, +/-30ppm; Manufacturer: Wurth Elektronik; Load Capacitance: 18pF; ComponentLink1Description: Manufacturer; ComponentLink1URL: http://www.we-online.de; ComponentLink2Description: Datasheet; ComponentLink2URL: https://katalog.we-online.com/pbs/datasheet/830055999.pdf; Operating Temperature: -40 to +85degC; Packaging: Tape and Reel; Manufacturer Part Number: 830055999; Published Date: July 2020; Size: CFPX-104; Frequency Stability: +/-30ppm; Frequency: 12MHz; Frequency Tolerance: +/-30ppm; Mounting Technology: SMT

## Sheet  Input.SchDoc
size A; SheetNumber: 5; SheetTotal: 6
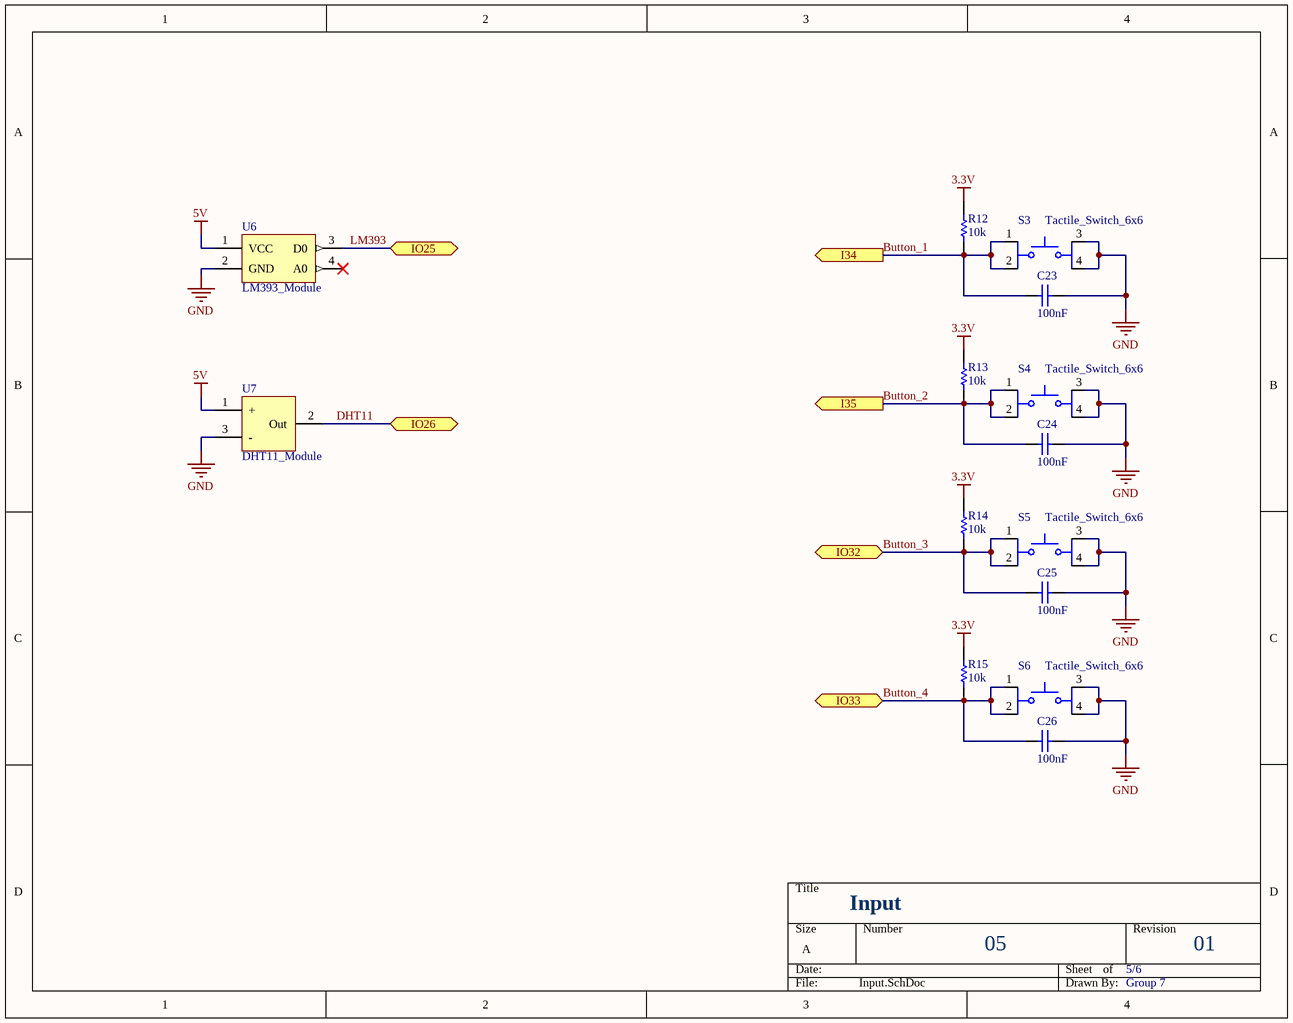
[diagram p5:  Input.SchDoc]

### Parts
C23  100nF  [CAP_0603]
C24  100nF  [CAP_0603]
C25  100nF  [CAP_0603]
C26  100nF  [CAP_0603]
R12  10k  [resistor_0603]
R13  10k  [resistor_0603]
R14  10k  [resistor_0603]
R15  10k  [resistor_0603]
S3  Tactile_Switch_6x6  [Tactile_Switch_6x6]
S4  Tactile_Switch_6x6  [Tactile_Switch_6x6]
S5  Tactile_Switch_6x6  [Tactile_Switch_6x6]
S6  Tactile_Switch_6x6  [Tactile_Switch_6x6]
U6  LM393_Module  [Flame Sensor]
U7  DHT11_Module  [DHT11_Module]

### Ports
I34 (out), I35 (out), IO25 (bidir), IO26 (bidir), IO32 (bidir), IO33 (bidir)

### Nets
3.3V: R12.1 R13.1 R14.1 R15.1
5V: U6.1(VCC) U7.1(+)
GND: C23.2 C24.2 C25.2 C26.2 S3.3 S3.4 S4.3 S4.4 S5.3 S5.4 S6.3 S6.4 U6.2(GND) U7.3(-)
Button_1: C23.1 R12.2 S3.1 S3.2 ; port I34
Button_2: C24.1 R13.2 S4.1 S4.2 ; port I35
Button_3: C25.1 R14.2 S5.1 S5.2 ; port IO32
Button_4: C26.1 R15.2 S6.1 S6.2 ; port IO33
DHT11: U7.2(Out) ; port IO26
LM393: U6.3(D0) ; port IO25

Not connected (* = marked no-connect by the designer): U6 4(A0)*

### Notes on the sheet
- Input
- 05
- 5/6
- 01
- Group 7

### Library data of the parts
C23-C26 = 01060310410: as C2 on sheet  Power Circuit; ComponentLink1Description: Manufacturer; ComponentLink1URL: http://www.we-online.de; ComponentLink2Description: Datasheet; ComponentLink2URL: https://www.we-online.com/catalog/datasheet/885012206095.pdf; Operating Temperature: -55 to +125degC; Packaging: Tape and Reel; Supply 1 URL: https://www.we-online.com/en/components/products/WCAP-CSGP-50VDC?sq=885012206095R#885012206095R; Supply 2 SN: *; Supply 2 URL: https://www.thegioiic.com/tu-gom-0603-100nf-0-1uf-50v; Dissipation Factor: *; Height: *; Mounting Technology: SMT; Size: 0603; Capacitance: 100nF; Technical Reference: *
R12-R15 = 0006031031: as R8 on sheet  MCU; Resistance: 10k; Size: 0603; Mounting Technology: SMT; ComponentLink1Description: Datasheet link; ComponentLink1URL: https://fscdn.rohm.com/en/products/databook/datasheet/passive/resistor/chip_resistor/esr-e.pdf; ComponentLink2Description: Supply 1 URL; ComponentLink2URL: https://www.mouser.vn/ProductDetail/ROHM-Semiconductor/ESR03EZPF1002?qs=sGAEpiMZZMvdGkrng054t67Efho1F8r6CDeAsqwFse8%3D; ComponentLink3Description: Supply 2 URL; ComponentLink3URL: https://www.digikey.com/en/products/detail/rohm-semiconductor/ESR03EZPF1002/1983429
S3-S6 = Tactile_Switch_6x6: Tactile Switch, 6x6mm
U6 = LM393_Module: Flame Sensor, 3.3V-5V, infrared, ouput: analog/digital.
U7 = DHT11_Module: Temperature & Humidity Sensor, 3.3V-5V, 5mA

## Sheet  Output.SchDoc
size A; SheetNumber: 6; SheetTotal: 6
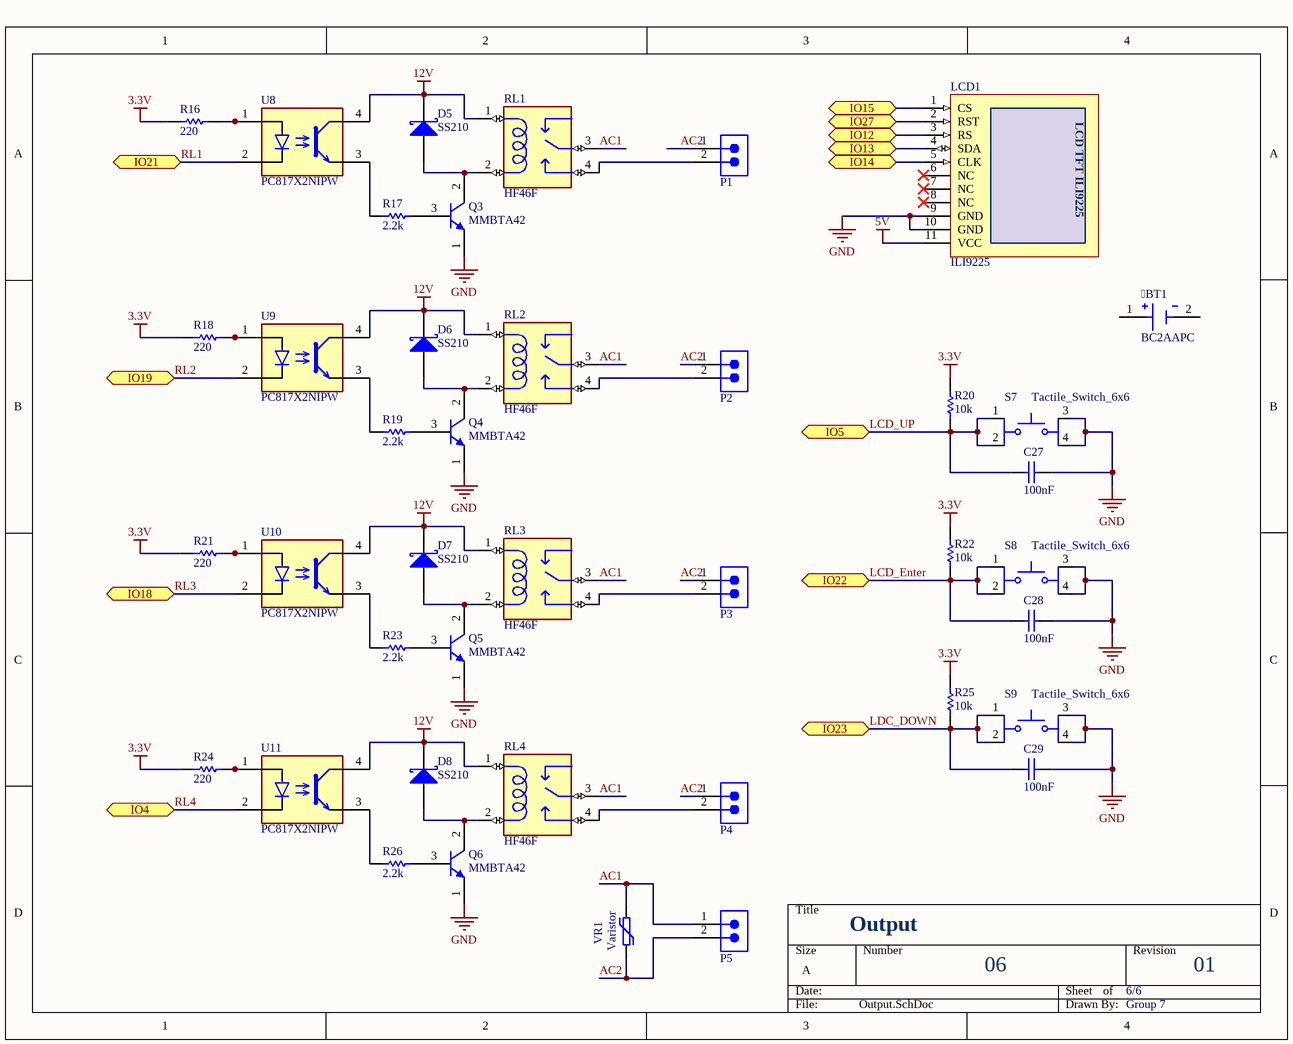
[diagram p6:  Output.SchDoc]

### Parts
BT1  BC2AAPC  [BC2AAPC]
C27  100nF  [CAP_0603]
C28  100nF  [CAP_0603]
C29  100nF  [CAP_0603]
D5  SS210  [SS34]
D6  SS210  [SS34]
D7  SS210  [SS34]
D8  SS210  [SS34]
LCD1  ILI9225  [LCD TFT ILI9225]
P1  691322310002  [691322310002]  (value not drawn)
P2  691322310002  [691322310002]  (value not drawn)
P3  691322310002  [691322310002]  (value not drawn)
P4  691322310002  [691322310002]  (value not drawn)
P5  691322310002  [691322310002]  (value not drawn)
Q3  MMBTA42  [SOT23B]
Q4  MMBTA42  [SOT23B]
Q5  MMBTA42  [SOT23B]
Q6  MMBTA42  [SOT23B]
R16  220  [resistor_0603]
R17  2.2k  [resistor_0603]
R18  220  [resistor_0603]
R19  2.2k  [resistor_0603]
R20  10k  [resistor_0603]
R21  220  [resistor_0603]
R22  10k  [resistor_0603]
R23  2.2k  [resistor_0603]
R24  220  [resistor_0603]
R25  10k  [resistor_0603]
R26  2.2k  [resistor_0603]
RL1  HF46F  [HF46F]
RL2  HF46F  [HF46F]
RL3  HF46F  [HF46F]
RL4  HF46F  [HF46F]
S7  Tactile_Switch_6x6  [Tactile_Switch_6x6]
S8  Tactile_Switch_6x6  [Tactile_Switch_6x6]
S9  Tactile_Switch_6x6  [Tactile_Switch_6x6]
U8  PC817X2NIPW  [PC817XI_SHP]
U9  PC817X2NIPW  [PC817XI_SHP]
U10  PC817X2NIPW  [PC817XI_SHP]
U11  PC817X2NIPW  [PC817XI_SHP]
VR1  Varistor  [07D471K]

### Ports
IO4 (bidir), IO5 (bidir), IO12 (bidir), IO13 (bidir), IO14 (bidir), IO15 (bidir), IO18 (bidir), IO19 (bidir), IO21 (bidir), IO22 (bidir), IO23 (bidir), IO27 (bidir)

### Nets
3.3V: R16.1 R18.1 R20.1 R21.1 R22.1 R24.1 R25.1
5V: LCD1.11(VCC)
12V: D5.2(K) D6.2(K) D7.2(K) D8.2(K) RL1.1(C1) RL2.1(C1) RL3.1(C1) RL4.1(C1) U8.4 U9.4 U10.4 U11.4
GND: C27.2 C28.2 C29.2 LCD1.9(GND) LCD1.10(GND) Q3.1(E) Q4.1(E) Q5.1(E) Q6.1(E) S7.3 S7.4 S8.3 S8.4 S9.3 S9.4
AC1: P5.1 RL1.3(C) RL2.3(C) RL3.3(C) RL4.3(C) VR1.1
AC2: P1.1 P2.1 P3.1 P4.1 P5.2 VR1.2
HSPICLK: LCD1.5(CLK) ; port IO14
HSPICS0: LCD1.1(CS) ; port IO15
HSPID: LCD1.4(SDA) ; port IO13
LCD_Enter: C28.1 R22.2 S8.1 S8.2 ; port IO22
LCD_RS: LCD1.3(RS) ; port IO12
LCD_RST: LCD1.2(RST) ; port IO27
LCD_UP: C27.1 R20.2 S7.1 S7.2 ; port IO5
LDC_DOWN: C29.1 R25.2 S9.1 S9.2 ; port IO23
RL1: U8.2 ; port IO21
RL2: U9.2 ; port IO19
RL3: U10.2 ; port IO18
RL4: U11.2 ; port IO4
NetD5_1: D5.1(A) Q3.2(C) RL1.2(C2)
NetD6_1: D6.1(A) Q4.2(C) RL2.2(C2)
NetD7_1: D7.1(A) Q5.2(C) RL3.2(C2)
NetD8_1: D8.1(A) Q6.2(C) RL4.2(C2)
NetP1_2: P1.2 RL1.4(NO)
NetP2_2: P2.2 RL2.4(NO)
NetP3_2: P3.2 RL3.4(NO)
NetP4_2: P4.2 RL4.4(NO)
NetQ3_3: Q3.3(B) R17.2
NetQ4_3: Q4.3(B) R19.2
NetQ5_3: Q5.3(B) R23.2
NetQ6_3: Q6.3(B) R26.2
NetR16_2: R16.2 U8.1
NetR17_1: R17.1 U8.3
NetR18_2: R18.2 U9.1
NetR19_1: R19.1 U9.3
NetR21_2: R21.2 U10.1
NetR23_1: R23.1 U10.3
NetR24_2: R24.2 U11.1
NetR26_1: R26.1 U11.3

Not connected (* = marked no-connect by the designer): BT1 1(POS) 2(NEG); LCD1 6(NC)* 7(NC)* 8(NC)*

### Notes on the sheet
- Output
- 06
- 6/6
- 01
- Group 7

### Library data of the parts
BT1 = CMP-00029-00003-2: Battery Holder Aa 2 Cell Pc Pin; Pins: 2; Supplier Locally URL: https://www.thegioiic.com/hop-pin-2xaa-xuyen-lo-han-pcb; Supplier Locally Name: Thegioiic; Mounting Technology: THT
C27-C29 = 01060310410: as C2 on sheet  Power Circuit; ComponentLink1Description: Manufacturer; ComponentLink1URL: http://www.we-online.de; ComponentLink2Description: Datasheet; ComponentLink2URL: https://www.we-online.com/catalog/datasheet/885012206095.pdf; Operating Temperature: -55 to +125degC; Packaging: Tape and Reel; Supply 1 URL: https://www.we-online.com/en/components/products/WCAP-CSGP-50VDC?sq=885012206095R#885012206095R; Supply 2 SN: *; Supply 2 URL: https://www.thegioiic.com/tu-gom-0603-100nf-0-1uf-50v; Dissipation Factor: *; Height: *; Mounting Technology: SMT; Size: 0603; Capacitance: 100nF; Technical Reference: *
D5-D8 = D Schottky: Schottky Diode; Published: 8-Jun-2000; LatestRevisionDate: 17-Jul-2002; LatestRevisionNote: Re-released for DXP Platform.; PackageReference: SMB; Publisher: Altium Limited; PackageDescription: DO-214-AA/SMB; 2 C-Bend Leads; Body 5.3 x 3.6 mm, inc. leads (LxW); Code_JEDEC: DO-214-AA
LCD1 = LCD TFT: The ILI9225 is a 262,144-color one-chip SoC driver for a-TFT liquid crystal display with resolution of 176RGBx220 dots, comprising a 528-channel source driver, a 220-channel gate driver, 87120 bytes RAM for graphic data of 176RGBx220 dots, and power supply circuit.; Display Color: 16BIT RGB 65K color; Screen Size: 2.2(inch); Resolution: 176*220 (Pixel); Module Interface: 4-wire SPI interface; Backlight: 3 White Led; Active Area: 34.85x43.56 (mm); Module PCB Size: 42.46x67.20 (mm); Operating Voltage: 5V/3.3V; Power Consumption: TBD; Rough Weight(Package containing): 23 (g); SKU: MAR2201; Type: TFT; Driver IC: ILI9225; Operating Temperature: -20℃~60℃; Storage Temperature: -30℃~70℃; ComponentLink1Description: Hshop; ComponentLink1URL: https://hshop.vn/products/man-hinh-lcd-tft-2-inch-ili9225-giao-tiep-spi; ComponentLink2Description: Thegioiic; ComponentLink2URL: https://www.thegioiic.com/lcd-2inch-176x220-tft-ili9225-giao-tiep-spi
P1-P5 = 691322310002: WR-TBL Series 322 Horizontal PCB Header, THT, pitch 3.81mm, 2p; Manufacturer: Wurth Elektronik; Modularity: No; Rated Current: 10A; Working Voltage: 300V; Supply 3 Name: ThegioiIC; ComponentLink1Description: Website Link; ComponentLink1URL: https://www.we-online.com/redexpert/article/691322310002?ad; ComponentLink2Description: Datasheet Link; ComponentLink2URL: https://www.we-online.com/redexpert/spec/691322310002?ad; Manufacturer Part Number: 691322310002; Category: Terminal Blocks; Match Code: WR-TBL; Mount: Through Hole; Operating Temperature Max: 105°C; Operating Temperature Min: -40°C; Packaging: Box; Application: Pluggable; Number of Pins: 2; Number of Rows: 1; Orientation: Horizontal; Pitch: 3.81mm; Supply 1 Name: *; Supply 1 SN: *; Supply 1 URL: *; Supply 2 Name: *; Supply 2 SN: *; Supply 2 URL: *; Supply 3 SN: *; Supply 3 URL 1: https://www.thegioiic.com/kf-3-81-2-r-terminal-block-plug-in-han-pcb-2-chan-cong-3-81mm-300v-10a; Supply 3 URL 2: https://www.thegioiic.com/ul-3-81-2-r-terminal-block-plug-in-han-pcb-2-chan-cong-3-81mm-300v-10a-ulo
Q3-Q6 = BC817: NPN Bipolar Transistor
R16 R18 R21 R24 = 0006032211: RES, 220 Ohm, size 0603, 1%; Resistance Tolerant: +/-1%; Rated Power: 1/4W; Supply 1 Name: Mouser; Supply 1 SN: 667-ERJ-UP3F2200V; Supply 2 Name: Digikey; Supply 2 SN: 10-ERJ-UP3F2200VTR-ND 10-ERJ-UP3F2200VCT-ND 10-ERJ-UP3F2200VDKR-ND; Resistance: 220; Size: 0603; Mounting Technology: SMT; ComponentLink1Description: Datasheet link; ComponentLink1URL: https://api.pim.na.industrial.panasonic.com/file_stream/main/fileversion/4484; ComponentLink2Description: Supply 1 URL; ComponentLink2URL: https://www.mouser.vn/ProductDetail/Panasonic/ERJ-UP3F2200V?qs=sGAEpiMZZMvdGkrng054twq3eZrCFN89E%252BhCXuCu3h8RslmTO1I28Q%3D%3D; ComponentLink3Description: Supply 2 URL; ComponentLink3URL: https://www.digikey.com/en/products/detail/panasonic-electronic-components/ERJ-UP3F2200V/12092129
R17 R19 R23 R26 = 0006032221: RES, 2.2k Ohm, size 0603, 1%; Resistance Tolerant: +/-1%; Rated Power: 1/4W; Supply 1 Name: Mouser; Supply 1 SN: 667-ERJ-UP3F2201V; Supply 2 Name: Digikey; Supply 2 SN: 10-ERJ-UP3F2201VTR-ND 10-ERJ-UP3F2201VCT-ND 10-ERJ-UP3F2201VDKR-ND; Supply 3 Name: thegioiic; Supply 3 SN: NA; Resistance: 2.2k; Size: 0603; Mounting Technology: SMT; ComponentLink1Description: Datasheet link; ComponentLink1URL: https://api.pim.na.industrial.panasonic.com/file_stream/main/fileversion/4484; ComponentLink2Description: Supply 1 URL; ComponentLink2URL: https://www.mouser.vn/ProductDetail/Panasonic/ERJ-UP3F2201V?qs=sGAEpiMZZMvdGkrng054twq3eZrCFN89KeaXYJ5LTWyJgfuuVVfZrw%3D%3D; ComponentLink3Description: Supply 2 URL; ComponentLink3URL: https://www.digikey.com/en/products/detail/panasonic-electronic-components/ERJ-UP3F2201V/12092708; ComponentLink4Description: Supply 3 URL; ComponentLink4URL: https://www.thegioiic.com/dien-tro-2-2-kohm-0603-1
R20 R22 R25 = 0006031031: as R8 on sheet  MCU; Resistance: 10k; Size: 0603; Mounting Technology: SMT; ComponentLink1Description: Datasheet link; ComponentLink1URL: https://fscdn.rohm.com/en/products/databook/datasheet/passive/resistor/chip_resistor/esr-e.pdf; ComponentLink2Description: Supply 1 URL; ComponentLink2URL: https://www.mouser.vn/ProductDetail/ROHM-Semiconductor/ESR03EZPF1002?qs=sGAEpiMZZMvdGkrng054t67Efho1F8r6CDeAsqwFse8%3D; ComponentLink3Description: Supply 2 URL; ComponentLink3URL: https://www.digikey.com/en/products/detail/rohm-semiconductor/ESR03EZPF1002/1983429
RL1-RL4 = HF46F: SeriesHF46F 12V 1 Form A 1A Gold Plated SUBMINIATURE INTERMEDIATE POWER RELAY; MF: Hongfa; Package: None; Price: None; Value: *; SnapEDA_Link: https://www.snapeda.com/parts/HF46F/Hongfa/view-part/?ref=snap; MP: HF46F; Availability: Not in stock; Check_prices: https://www.snapeda.com/parts/HF46F/Hongfa/view-part/?ref=eda
S7-S9 = Tactile_Switch_6x6: Tactile Switch, 6x6mm
U8-U11 = PC817X2NIPW: PC817 series, SMD, I_F (max) = 500mA, V_F (max) = 1.4V. / Breakdown voltage: BV_CE = 80V, BV_BE = 6V.
VR1 = 07D471K 470V

## Nets that join several sheets
3.3V:  Power Circuit (6 pins),  MCU (7 pins),  Input (R12.1 R13.1 R14.1 R15.1),  Output (7 pins)
5V:  Power Circuit (9 pins),  MCU (C16.2 C17.1 D4.2 U3.16),  Input (U6.1 U7.1),  Output (LCD1.11)
12V:  Power Circuit (7 pins),  Output (12 pins)
GND:  Power Circuit (22 pins),  MCU (24 pins),  Input (14 pins),  Output (15 pins)
Button_1:  MCU (U5.6),  Input (C23.1 R12.2 S3.1 S3.2)
Button_2:  MCU (U5.7),  Input (C24.1 R13.2 S4.1 S4.2)
Button_3:  MCU (U5.8),  Input (C25.1 R14.2 S5.1 S5.2)
Button_4:  MCU (U5.9),  Input (C26.1 R15.2 S6.1 S6.2)
DHT11:  MCU (U5.11),  Input (U7.2)
HSPICLK:  MCU (U5.13),  Output (LCD1.5)
HSPICS0:  MCU (U5.23),  Output (LCD1.1)
HSPID:  MCU (U5.16),  Output (LCD1.4)
LCD_Enter:  MCU (U5.36),  Output (C28.1 R22.2 S8.1 S8.2)
LCD_RS:  MCU (U5.14),  Output (LCD1.3)
LCD_RST:  MCU (U5.12),  Output (LCD1.2)
LCD_UP:  MCU (U5.29),  Output (C27.1 R20.2 S7.1 S7.2)
LDC_DOWN:  MCU (U5.37),  Output (C29.1 R25.2 S9.1 S9.2)
LM393:  MCU (U5.10),  Input (U6.3)
RL1:  MCU (U5.33),  Output (U8.2)
RL2:  MCU (U5.31),  Output (U9.2)
RL3:  MCU (U5.30),  Output (U10.2)
RL4:  MCU (U5.26),  Output (U11.2)